# Altium schematic sheet Battery_Charger.SchDoc: Battery Charger
size A4
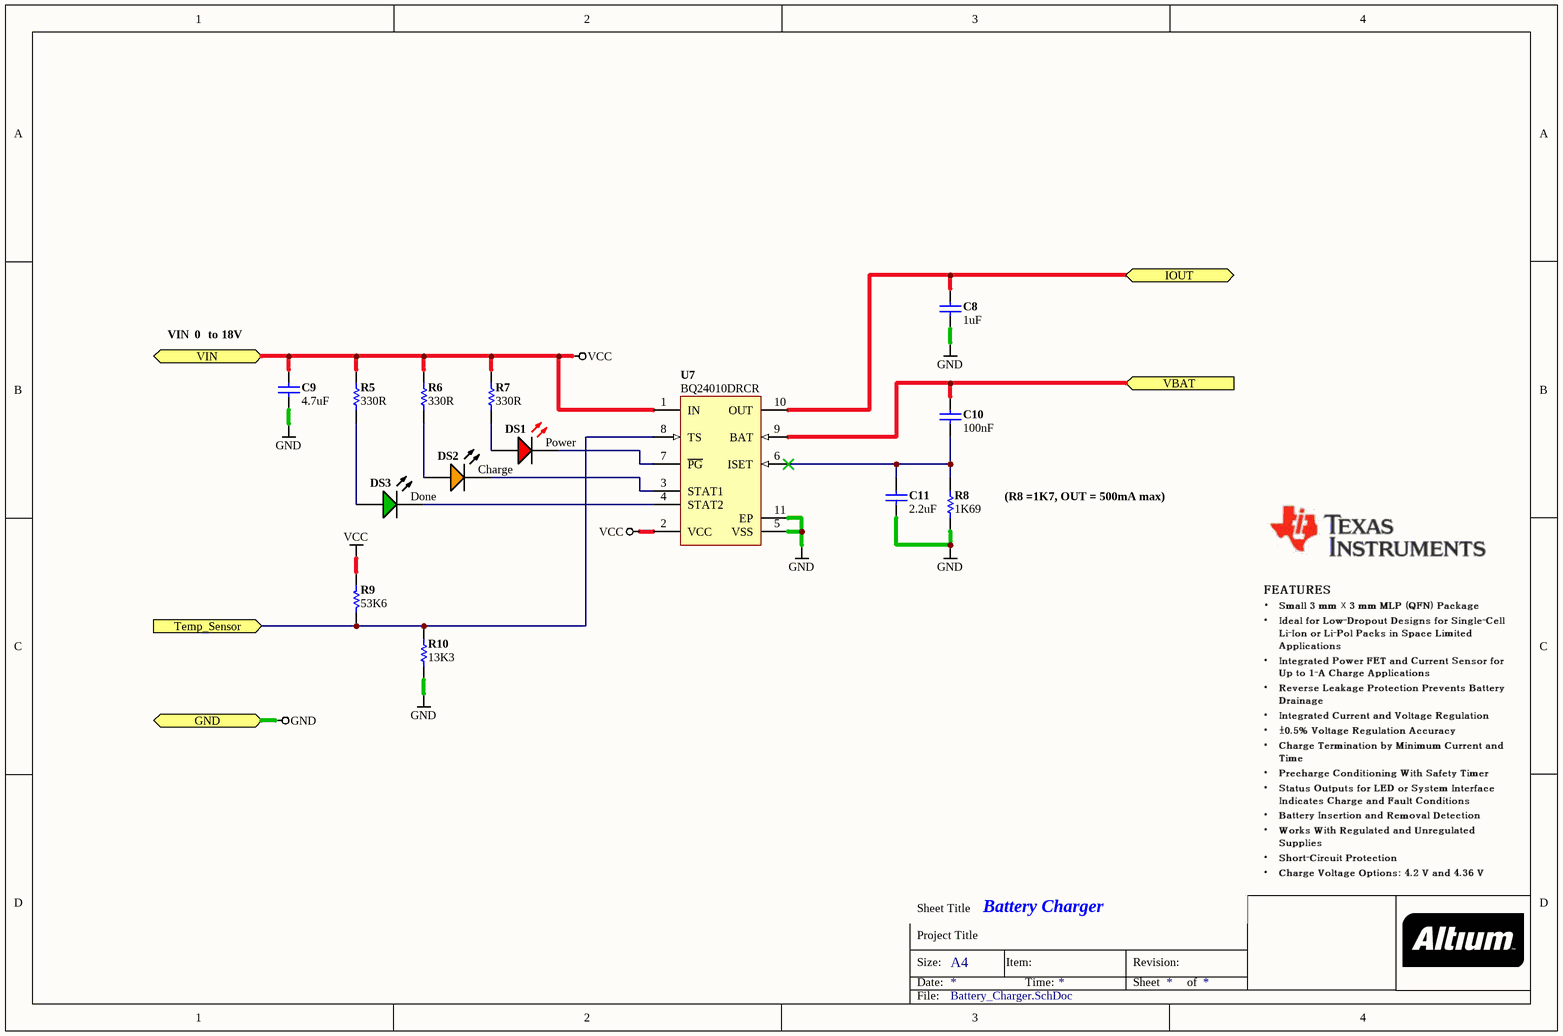
[diagram p0: Battery_Charger.SchDoc]

## Parts
C8  value 1uF  [CAPC0402(1005)60_N]  (hidden comment: CAP 1uF 10V 0402(1005))
C9  value 4.7uF  [CAPC0603(1608)100_N]  (hidden comment: CAP 4.7uF 16V 0603(1608))
C10  value 100nF  [CAPC0402(1005)60_L]  (hidden comment: CAP 100nF 10V 0402(1005))
C11  value 2.2uF  [CAPC0603(1608)55_N]  (hidden comment: CAP 2.2uF 16V 0603(1608))
DS1  APG1608SURKC/T  [KING-0603(1608)25-Red]  (value not drawn)
DS2  APG1608SEKC/T  [KING-0603(1608)25-Orange]  (value not drawn)
DS3  APG1608CGKC/T  [KING-0603(1608)25-Green]  (value not drawn)
R5  330R  [RESC0402(1005)_N]
R6  330R  [RESC0402(1005)_N]
R7  330R  [RESC0402(1005)_N]
R8  1K69  [RESC0402(1005)_N]
R9  53K6  [RESC0402(1005)_L]
R10  13K3  [RESC0402(1005)_L]
U7  BQ24010DRCR  [DRC10-2400X1650TP]

## Ports
GND, IOUT, Temp_Sensor (in), VBAT (in), VIN

## Nets
GND: C8.2 C9.2 C11.2 R8.1 R10.2 U7.5(VSS) U7.11(EP) ; port GND
VCC: C9.1 R5.2 R6.2 R7.2 R9.2 U7.1(IN) U7.2(VCC) ; port VIN
IOUT: C8.1 U7.10(OUT) ; port IOUT
Temp_Sensor: R9.1 R10.1 U7.8(TS) ; port Temp_Sensor
VBAT: C10.1 U7.9(BAT) ; port VBAT
NetC10_2: C10.2 C11.1 R8.2 U7.6(ISET)
NetDS1_1: DS1.1(A) R7.1
NetDS1_2: DS1.2(K) U7.7(~{PG})
NetDS2_1: DS2.1(A) R6.1
NetDS2_2: DS2.2(K) U7.3(STAT1)
NetDS3_1: DS3.1(A) R5.1
NetDS3_2: DS3.2(K) U7.4(STAT2)

## Notes on the sheet
- VIN
- 0
- to
- 18V
- (near DS1) Power
- Done
- Charge
- (R8 =1K7, OUT = 500mA max)
- Sheet Title
- Project Title
- Size:
- Date:
- A4
- Item:
- Time:
- Revision:
- Sheet
- of
- File:

## Library data of the parts
C8 = CMP-1034-02116-1: CAP 1uF 10V ±10% 0402 (1005 Metric) Thickness 0.6mm SMD; Case-Metric: 1005; Case-EIA: 0402; Technology: SMT; Max Thickness: 0.6 mm; Rated Voltage: 10 V; Tolerance: ±10%
C9 = CMP-1035-02789-1: CAP 4.7uF 16V ±20% 0603 (1608 Metric) Thickness 1mm SMD; Case-EIA: 0603; Case-Metric: 1608; Max Thickness: 1 mm; Rated Voltage: 16 V; Tolerance: ±20%; Technology: SMT
C10 = CMP-1034-02064-1: CAP 100nF 10V ±5% 0402 (1005 Metric) Thickness 0.6mm SMD; Case-EIA: 0402; Case-Metric: 1005; Max Thickness: 0.6 mm; Tolerance: ±5%; Rated Voltage: 10 V; Technology: SMT
C11 = CMP-1035-02762-1: CAP 2.2uF 16V ±10% 0603 (1608 Metric) Thickness 0.55mm SMD; Case-EIA: 0603; Case-Metric: 1608; Max Thickness: 0.55 mm; Technology: SMT; Rated Voltage: 16 V; Tolerance: ±10%
DS1 = CMP-5037-00006-1: LED, SMT, 0603(1608), 0.25mm thickness, Red; Power Dissipation: 75 mW; IEC-class: Light emitting diodes; Reverse Voltage: 5 V; Forward Current: 30 mA; Class: Optoelectronic; Packing Type: 2000 pcs / reel; Storage Temperature: -40 to +85 degC; Sub-class: LED; Datasheet: http://www.kingbrightusa.com/images/catalog/spec/APG1608SURKC-T.pdf
DS2 = CMP-5037-00005-1: LED, SMT, 0603(1608), 0.25mm thickness, Super Bright Orange; Power Dissipation: 78 mW; Packing Type: 2000 pcs / reel; Forward Current: 30 mA; Reverse Voltage: 5 V; Class: Optoelectronic; IEC-class: Light emitting diodes; Storage Temperature: -40 to +85 degC; Datasheet: http://www.kingbrightusa.com/images/catalog/SPEC/APG1608SEKC-T.pdf; Sub-class: LED
DS3 = CMP-5037-00004-1: LED, SMT, 0603(1608), 0.25mm thickness, Green; Power Dissipation: 78 mW; Packing Type: 2000 pcs / reel; Forward Current: 30 mA; Reverse Voltage: 5 V; Class: Optoelectronic; IEC-class: Light emitting diodes; Storage Temperature: -40 to +85 degC; Datasheet: http://www.kingbrightusa.com/images/catalog/SPEC/APG1608CGKC-T.pdf; Sub-class: LED
R5-R7 = CMP-1011-00062-1: 330R 0.063W 5% 0402 (1005 Metric)  SMD; Case-EIA: 0402; Value: 330.00 Ohm; Case-Metric: 1005; Tolerance: 5 %; Technology: SMT; Power: 0.063 W
R8 = CMP-1011-00534-1: 1K69 0.063W 1% 0402 (1005 Metric)  SMD; Case-EIA: 0402; Case-Metric: 1005; Value: 1690.00 Ohm; Power: 0.063 W; Technology: SMT; Tolerance: 1 %
R9 = CMP-1011-00706-1: 53K6 0.063W 1% 0402 (1005 Metric)  SMD; Value: 53600.00 Ohm; Case-Metric: 1005; Case-EIA: 0402; Power: 0.063 W; Technology: SMT; Tolerance: 1 %
R10 = CMP-1011-00636-1: 13K3 0.063W 1% 0402 (1005 Metric)  SMD; Value: 13300.00 Ohm; Case-EIA: 0402; Case-Metric: 1005; Technology: SMT; Power: 0.063 W; Tolerance: 1 %
U7 = CMP-0321-00536-1: bqTINY (TM) Linear 1-Cell Li-Ion Charger with 1 A FET, AC Present and Temp Sense in QFN-10, 3 V, -40 to 85 degC, 10-pin SON (DRC), Green (RoHS & no Sb/Br); Manufacturer: Texas Instruments; Li-Ion: Y; Vin(Min)(V): 3; SubFamily: Battery Charge Management; Lead Acid: N; PackageDescription: 10-Pin Plastic Small Outline No-Lead, 3 x 3 x 1 mm Body, 0.5 mm Pitch, Exposed Pad; PackageVersion: revL, Sep-2011; PartNumber: BQ24010DRCR; PackageReference: DRC10-2400X1650TP; NiMH: N; Mounting Technology: Surface Mount; DatasheetVersion: SLUS530J; ComponentLink1URL: http://www.ti.com/general/docs/lit/getliterature.tsp?genericPartNumber=BQ24010&fileType=pdf; Li-Polymer: Y; NiCd: N; Over Voltage Protection: N; Eco-Plan: Green (RoHS & no Sb/Br); ComponentLink1Description: Datasheet